# EAGLE design stm32-stamp64 (EAGLE 5.11)

## Sheet 1 of 2
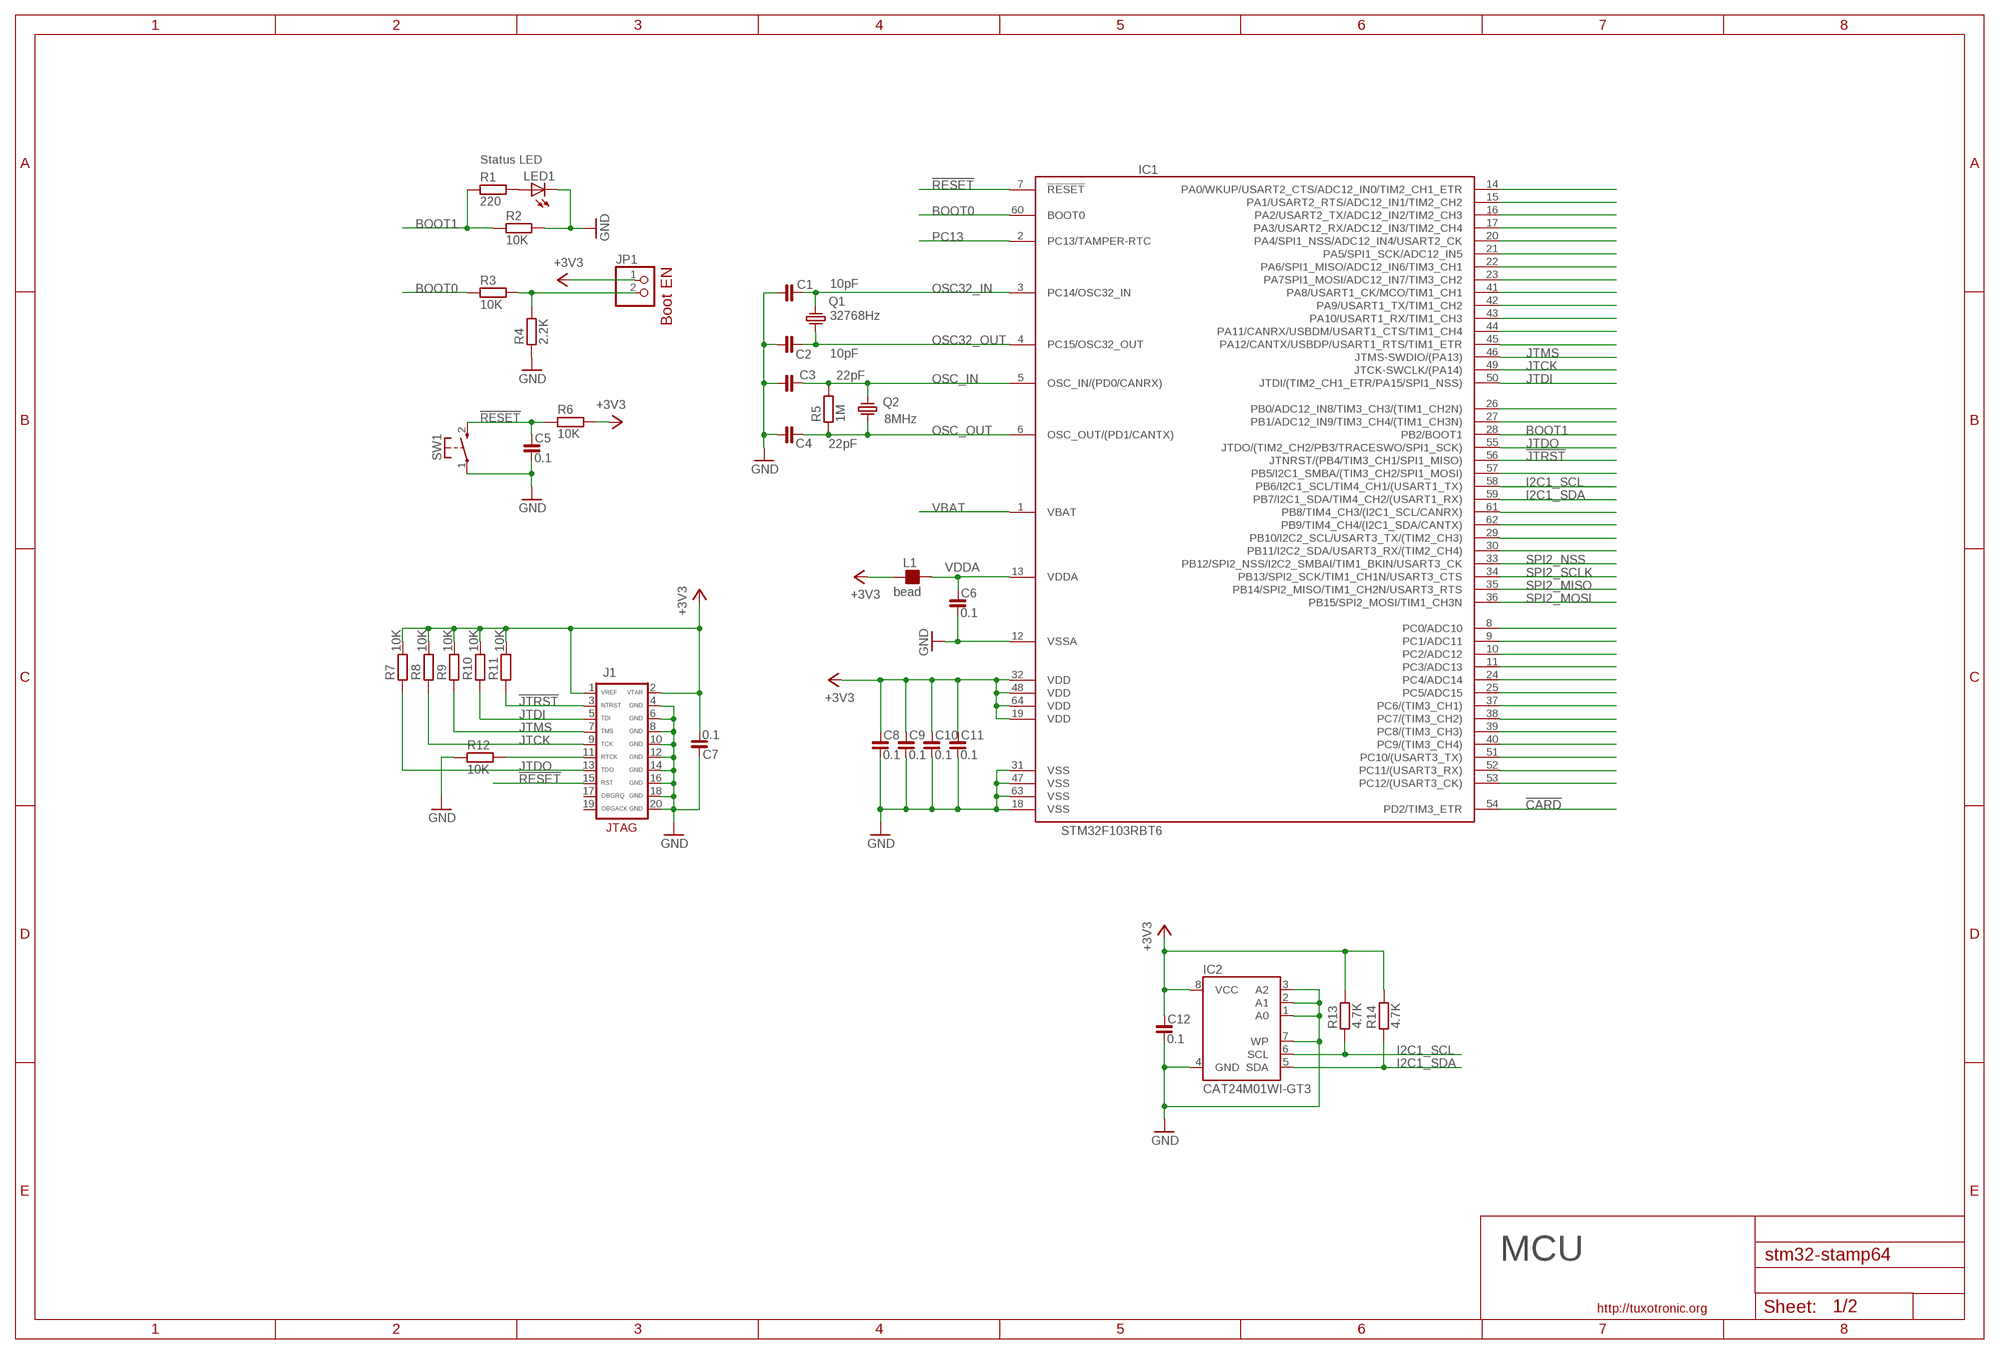
[diagram p0: schematic, sheet 1]

### Parts
C1  10pF  C_0603  [C0603]
C2  10pF  C_0603  [C0603]
C3  22pF  C_0603  [C0603]
C4  22pF  C_0603  [C0603]
C5  0.1  C_0603  [C0603]
C6  0.1  C_0603  [C0603]
C7  0.1  C_0603  [C0603]
C8  0.1  C_0603  [C0603]
C9  0.1  C_0603  [C0603]
C10  0.1  C_0603  [C0603]
C11  0.1  C_0603  [C0603]
C12  0.1  C_0603  [C0603]
IC1  STM32F103RBT6  STM32F103R  [TQFP64]
IC2  CAT24M01WI-GT3  AT24C256S  [SO08]
J1  JTAG-ARM-HDR2MM  [2X10M]
JP1  PINHD-1X2_2.00  [1X02M]
L1  bead  FB_0603  [L0603]
LED1  LEDCHIP-LED0805  [CHIP-LED0805]
Q1  32768Hz  CRYSTAL-TC26H  [TC26H]
Q2  8MHz  CRYSTAL-HC49S  [HC49/S]
R1  220  R_0603  [R0603]
R2  10K  R_0603  [R0603]
R3  10K  R_0603  [R0603]
R4  2.2K  R_0603  [R0603]
R5  1M  R_0603  [R0603]
R6  10K  R_0603  [R0603]
R7  10K  R_0603  [R0603]
R8  10K  R_0603  [R0603]
R9  10K  R_0603  [R0603]
R10  10K  R_0603  [R0603]
R11  10K  R_0603  [R0603]
R12  10K  R_0603  [R0603]
R13  4.7K  R_0603  [R0603]
R14  4.7K  R_0603  [R0603]
SW1  KSS-2EG4430  [KSS-2EG4430]

### Nets
!CARD: IC1.54(PD2/TIM3_ETR) ; also sheet 2
!JTRST: IC1.56(JTNRST/(PB4/TIM3_CH1/SPI1_MISO)) J1.3(NTRST) R11.1
!RESET: C5.1 IC1.7(!RESET) J1.15(RST) R6.1 SW1.2(S)
+3V3: C7.2 C8.1 C9.1 C10.1 C11.1 C12.1 IC1.19(VDD) IC1.32(VDD) IC1.48(VDD) IC1.64(VDD) IC2.8(VCC) J1.1(VREF) J1.2(VTAR) JP1.1 L1.1 R6.2 R7.2 R8.2 R9.2 R10.2 R11.2 R13.2 R14.2 ; also sheet 2
BOOT0: IC1.60(BOOT0) R3.1
BOOT1: IC1.28(PB2/BOOT1) R1.1 R2.1
GND: C1.2 C2.2 C3.2 C4.2 C5.2 C6.2 C7.1 C8.2 C9.2 C10.2 C11.2 C12.2 IC1.12(VSSA) IC1.18(VSS) IC1.31(VSS) IC1.47(VSS) IC1.63(VSS) IC2.1(A0) IC2.2(A1) IC2.3(A2) IC2.4(GND) IC2.7(WP) J1.4(GND) J1.6(GND) J1.8(GND) J1.10(GND) J1.12(GND) J1.14(GND) J1.16(GND) J1.18(GND) J1.20(GND) LED1.C R2.2 R4.1 R12.1 SW1.1(P) ; also sheet 2
I2C1_SCL: IC1.58(PB6/I2C1_SCL/TIM4_CH1/(USART1_TX)) IC2.6(SCL) R13.1
I2C1_SDA: IC1.59(PB7/I2C1_SDA/TIM4_CH2/(USART1_RX)) IC2.5(SDA) R14.1
JTCK: IC1.49(JTCK-SWCLK/(PA14)) J1.9(TCK) R8.1
JTDI: IC1.50(JTDI/(TIM2_CH1_ETR/PA15/SPI1_NSS)) J1.5(TDI) R10.1
JTDO: IC1.55(JTDO/(TIM2_CH2/PB3/TRACESWO/SPI1_SCK)) J1.13(TDO) R7.1
JTMS: IC1.46(JTMS-SWDIO/(PA13)) J1.7(TMS) R9.1
N$3: JP1.2 R3.2 R4.2
N$6: J1.11(RTCK) R12.2
N$11: IC1.14(PA0/WKUP/USART2_CTS/ADC12_IN0/TIM2_CH1_ETR)
N$12: IC1.15(PA1/USART2_RTS/ADC12_IN1/TIM2_CH2)
N$13: IC1.16(PA2/USART2_TX/ADC12_IN2/TIM2_CH3)
N$14: IC1.17(PA3/USART2_RX/ADC12_IN3/TIM2_CH4)
N$15: IC1.20(PA4/SPI1_NSS/ADC12_IN4/USART2_CK)
N$16: IC1.21(PA5/SPI1_SCK/ADC12_IN5)
N$17: IC1.22(PA6/SPI1_MISO/ADC12_IN6/TIM3_CH1)
N$18: IC1.23(PA7SPI1_MOSI/ADC12_IN7/TIM3_CH2)
N$19: IC1.41(PA8/USART1_CK/MCO/TIM1_CH1)
N$20: IC1.42(PA9/USART1_TX/TIM1_CH2)
N$21: IC1.43(PA10/USART1_RX/TIM1_CH3)
N$22: IC1.44(PA11/CANRX/USBDM/USART1_CTS/TIM1_CH4)
N$23: IC1.45(PA12/CANTX/USBDP/USART1_RTS/TIM1_ETR)
N$24: IC1.26(PB0/ADC12_IN8/TIM3_CH3/(TIM1_CH2N))
N$25: IC1.27(PB1/ADC12_IN9/TIM3_CH4/(TIM1_CH3N))
N$26: IC1.57(PB5/I2C1_SMBA/(TIM3_CH2/SPI1_MOSI))
N$27: IC1.61(PB8/TIM4_CH3/(I2C1_SCL/CANRX))
N$28: IC1.62(PB9/TIM4_CH4/(I2C1_SDA/CANTX))
N$29: IC1.29(PB10/I2C2_SCL/USART3_TX/(TIM2_CH3))
N$30: LED1.A R1.2
N$31: IC1.30(PB11/I2C2_SDA/USART3_RX/(TIM2_CH4))
N$33: IC1.53(PC12/(USART3_CK))
N$34: IC1.52(PC11/(USART3_RX))
N$35: IC1.51(PC10/(USART3_TX))
N$36: IC1.40(PC9/(TIM3_CH4))
N$37: IC1.39(PC8/(TIM3_CH3))
N$38: IC1.38(PC7/(TIM3_CH2))
N$39: IC1.37(PC6/(TIM3_CH1))
N$40: IC1.25(PC5/ADC15)
N$41: IC1.24(PC4/ADC14)
N$42: IC1.11(PC3/ADC13)
N$43: IC1.10(PC2/ADC12)
N$44: IC1.9(PC1/ADC11)
N$45: IC1.8(PC0/ADC10)
OSC32_IN: C1.1 IC1.3(PC14/OSC32_IN) Q1.2
OSC32_OUT: C2.1 IC1.4(PC15/OSC32_OUT) Q1.1
OSC_IN: C3.1 IC1.5(OSC_IN/(PD0/CANRX)) Q2.1 R5.2
OSC_OUT: C4.1 IC1.6(OSC_OUT/(PD1/CANTX)) Q2.2 R5.1
PC13: IC1.2(PC13/TAMPER-RTC)
SPI2_MISO: IC1.35(PB14/SPI2_MISO/TIM1_CH2N/USART3_RTS) ; also sheet 2
SPI2_MOSI: IC1.36(PB15/SPI2_MOSI/TIM1_CH3N) ; also sheet 2
SPI2_NSS: IC1.33(PB12/SPI2_NSS/I2C2_SMBAI/TIM1_BKIN/USART3_CK) ; also sheet 2
SPI2_SCLK: IC1.34(PB13/SPI2_SCK/TIM1_CH1N/USART3_CTS) ; also sheet 2
VBAT: IC1.1(VBAT)
VDDA: C6.1 IC1.13(VDDA) L1.2
Unconnected: J1.17(OBGRQ) J1.19(OBGACK)

### Notes on the sheet
- Status LED
- Boot EN
- MCU

## Sheet 2 of 2
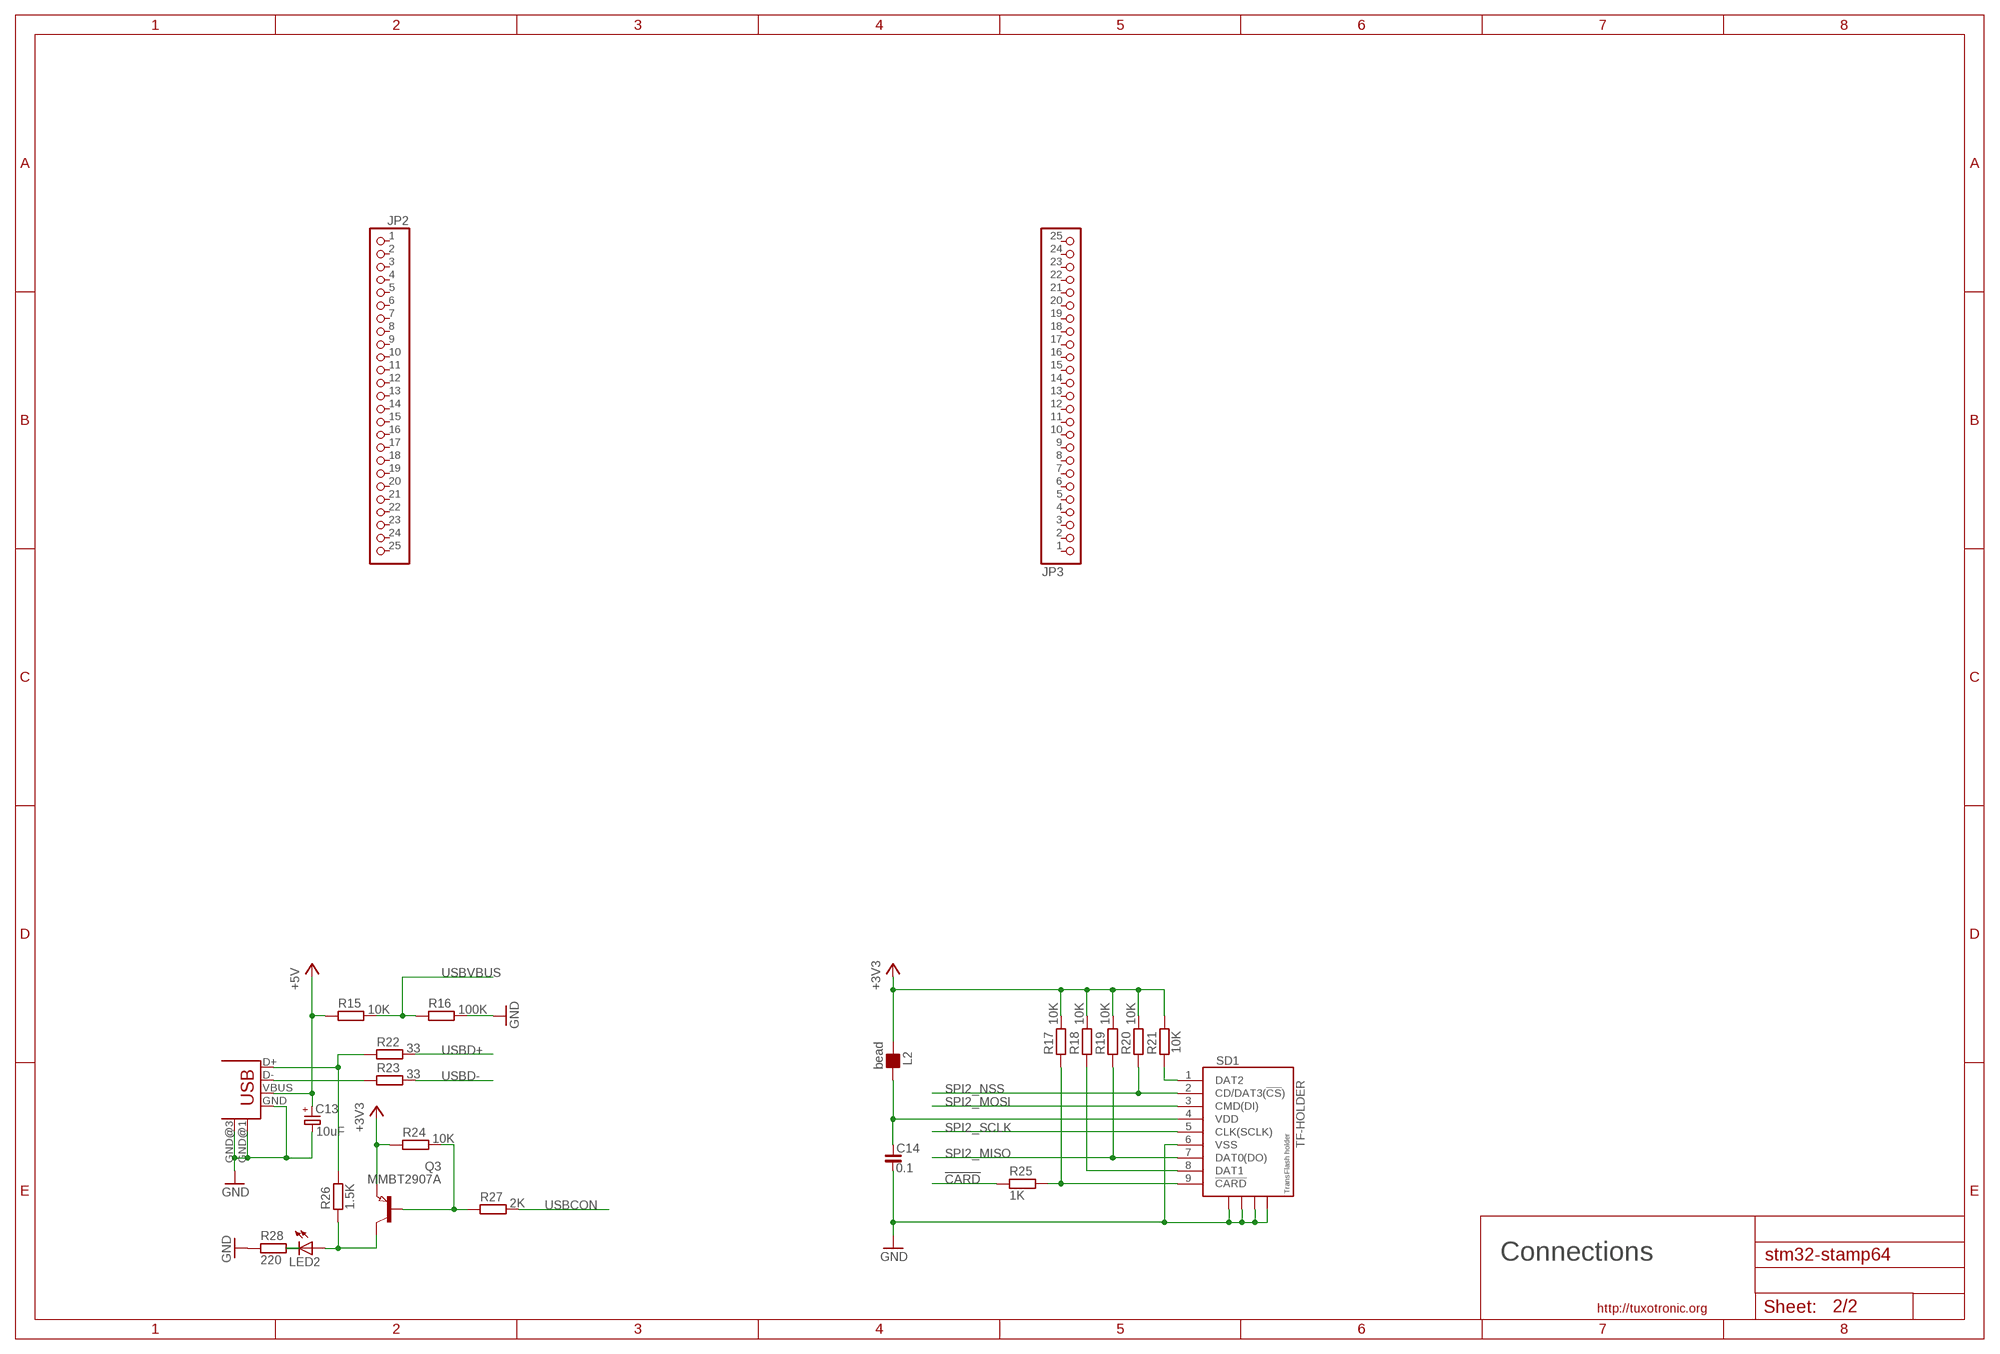
[diagram p1: schematic, sheet 2]

### Parts
C13  10uF  CP_SMCA  [SMC_A]
C14  0.1  C_0603  [C0603]
JP2  PINHD-1X25_2.00  [1X25M]
JP3  PINHD-1X25_2.00  [1X25M]
L2  bead  FB_0603  [L0603]
LED2  LEDCHIP-LED0603  [CHIP-LED0603]
Q3  MMBT2907A  PNP-TRANSISTOR_SOT23  [SOT23]
R15  10K  R_0603  [R0603]
R16  100K  R_0603  [R0603]
R17  10K  R_0603  [R0603]
R18  10K  R_0603  [R0603]
R19  10K  R_0603  [R0603]
R20  10K  R_0603  [R0603]
R21  10K  R_0603  [R0603]
R22  33  R_0603  [R0603]
R23  33  R_0603  [R0603]
R24  10K  R_0603  [R0603]
R25  1K  R_0603  [R0603]
R26  1.5K  R_0603  [R0603]
R27  2K  R_0603  [R0603]
R28  220  R_0603  [R0603]
SD1  TF-HOLDER  [TF-PULL]
USB1  USB-MB-S  [USB-MB-S]

### Nets
!CARD: R25.1 ; also sheet 1
!CD: R17.1 R25.2 SD1.9(!CARD)
+3V3: L2.1 Q3.2(E) R17.2 R18.2 R19.2 R20.2 R21.2 R24.1 ; also sheet 1
+5V: C13.+ R15.1 USB1.VBUS
GND: C13.- C14.2 R16.2 R28.1 SD1.6(VSS) SD1.S1 SD1.S2 SD1.S3 SD1.S4 USB1.GND USB1.GND@1(GND) USB1.GND@3(GND) ; also sheet 1
N$1: C14.1 L2.2 SD1.4(VDD)
N$2: R21.1 SD1.1(DAT2)
N$4: R18.1 SD1.8(DAT1)
N$5: R23.1 USB1.D-
N$7: Q3.1(B) R24.2 R27.1
N$8: R22.1 R26.2 USB1.D+
N$9: LED2.C R28.2
N$10: LED2.A Q3.3(C) R26.1
SPI2_MISO: R19.1 SD1.7(DAT0(DO)) ; also sheet 1
SPI2_MOSI: SD1.3(CMD(DI)) ; also sheet 1
SPI2_NSS: R20.1 SD1.2(CD/DAT3(!CS!)) ; also sheet 1
SPI2_SCLK: SD1.5(CLK(SCLK)) ; also sheet 1
USBCON: R27.2
USBD+: R22.2
USBD-: R23.2
USBVBUS: R15.2 R16.1
Unconnected: JP2.1 JP2.2 JP2.3 JP2.4 JP2.5 JP2.6 JP2.7 JP2.8 JP2.9 JP2.10 JP2.11 JP2.12 JP2.13 JP2.14 JP2.15 JP2.16 JP2.17 JP2.18 JP2.19 JP2.20 JP2.21 JP2.22 JP2.23 JP2.24 JP2.25 JP3.1 JP3.2 JP3.3 JP3.4 JP3.5 JP3.6 JP3.7 JP3.8 JP3.9 JP3.10 JP3.11 JP3.12 JP3.13 JP3.14 JP3.15 JP3.16 JP3.17 JP3.18 JP3.19 JP3.20 JP3.21 JP3.22 JP3.23 JP3.24 JP3.25

### Notes on the sheet
- Connections

## Library data of the parts
C1-C12 C14 = rc-master-smd:C_: NON-POLARIZED CAP
C13 = rc-master-smd:CP_: POLARIZED CAP
IC1 = stm32:STM32F103R: Medium-density performance line ARM-based 32-bit MCU with 64 or 128 KB Flash, USB, CAN, 7 timers, 2 ADCs, 9 communication interfaces
IC2 = stm32-by-pb:AT24C*: 2-wire serial EEPROM
J1 = atmel-arm:JTAG-ARM-: JTAG Programming/Debug Connector
JP1 = pinhead-fixdrills:PINHD-1X2: PIN HEADER
JP2 JP3 = pinhead-fixdrills:PINHD-1X25: PIN HEADER
L1 L2 = rc-master-smd:FB_: FERRITE BEAD
LED1 LED2 = led:LED: LED OSRAM: - CHIPLED LG R971, LG N971, LY N971, LG Q971, LY Q971, LO R971, LY R971 LH N974, LH R974 LS Q976, LO Q976, LY Q976 LO Q996 - Hyper CHIPLED LW Q18S LB Q993, LB Q99A, LB R99A - SideLED LS A670, LO A670, LY A670, LG A670, LP A670 LB A673, LV A673, LT A673, LW A673 LH A674 LY A675 LS A676, LA A676, LO A676, LY A676, LW A676 LS A679, LY A679, LG A679 - Hyper Micro SIDELED® LS Y876, LA Y876, LO Y876, LY Y876 LT Y87S - SmartLED LW L88C, LW L88S LB L89C, LB L89S, LG L890 LS L89K, LO L89K, LY L89K LS L896, LA L896, LO L896, LY L896 - TOPLED LS T670, LO T670, LY T670, LG T670, LP T670 LSG T670, LSP T670, LSY T670, LOP T670, LYG T670 LG T671, LOG T671, LSG T671 LB T673, LV T673, LT T673, LW T673 LH T674 LS T676, LA T676, LO T676, LY T676, LB T676, LH T676, LSB T676, LW T676 LB T67C, LV T67C, LT T67C, LS T67K, LO T67K, LY T67K, LW E67C LS E67B, LA E67B, LO E67B, LY E67B, LB E67C, LV E67C, LT E67C LW T67C LS T679, LY T679, LG T679 LS T770, LO T770, LY T770, LG T770, LP T770 LB T773, LV T773, LT T773, LW T773 LH T774 LS E675, LA E675, LY E675, LS T675 LS T776, LA T776, LO T776, LY T776, LB T776 LHGB T686 LT T68C, LB T68C - Hyper Mini TOPLED® LB M676 - Mini TOPLED Santana® LG M470 LS M47K, LO M47K, LY M47K Source: http://www.osram.convergy.de - LUMILED® LXK2-PW12-R00, LXK2-PW12-S00, LXK2-PW14-U00, LXK2-PW14-V00 LXK2-PM12-R00, LXK2-PM12-S00, LXK2-PM14-U00 LXK2-PE12-Q00, LXK2-PE12-R00, LXK2-PE12-S00, LXK2-PE14-T00, LXK2-PE14-U00 LXK2-PB12-K00, LXK2-PB12-L00, LXK2-PB12-M00, LXK2-PB14-N00, LXK2-PB14-P00, LXK2-PB14-Q00 LXK2-PR12-L00, LXK2-PR12-M00, LXK2-PR14-Q00, LXK2-PR14-R00 LXK2-PD12-Q00, LXK2-PD12-R00, LXK2-PD12-S00 LXK2-PH12-R00, LXK2-PH12-S00 LXK2-PL12-P00, LXK2-PL12-Q00, LXK2-PL12-R00 Source: www.luxeon.com
Q1 Q2 = discrete:CRYSTAL-: CRYSTAL
Q3 = semicon-smd-ipc:PNP-TRANSISTOR_: PNP TRANSISTOR
R1-R28 = rc-master-smd:R_: RESISTOR
SD1 = sd-mmc:TF-HOLDER: TF / Micro SD socket is PUSH-PUSH type, the card can be pushed into and auto locked and pushed out by simply press the card. Surface Mounting type.
SW1 = buttons:KSS-2EG4430: Size: 3x6mm Height: 5mm from PCB Rating: DC12v 50mA Travel: 0.25±0.10mm Operating Force: 180±50gf Return Force: 60gf min Contact resistance: 100m? max Insulation resistance: 100M? min Operating life?50,000 cycles
USB1 = usb:USB: USB Connectors

## Board
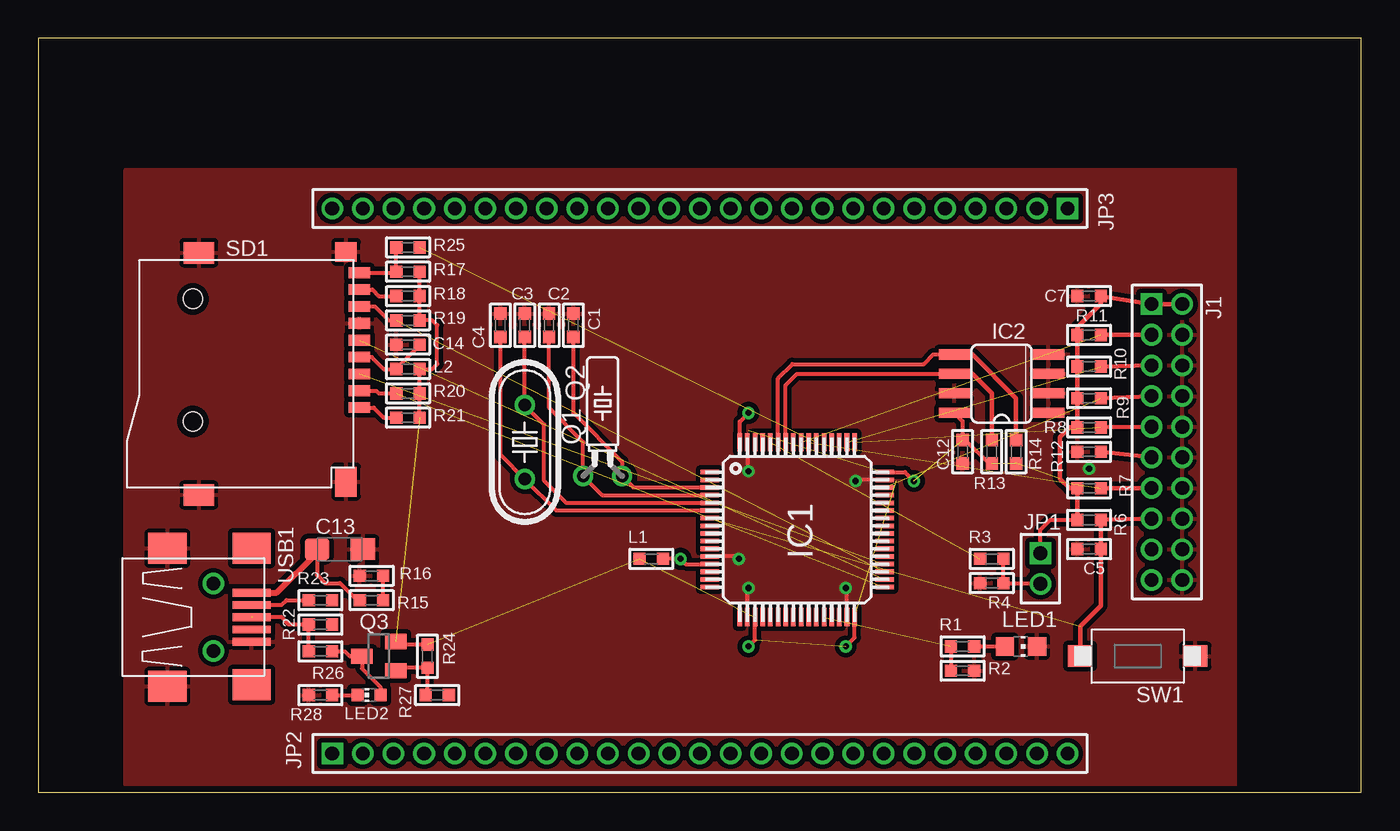
[diagram p2: board, top side]
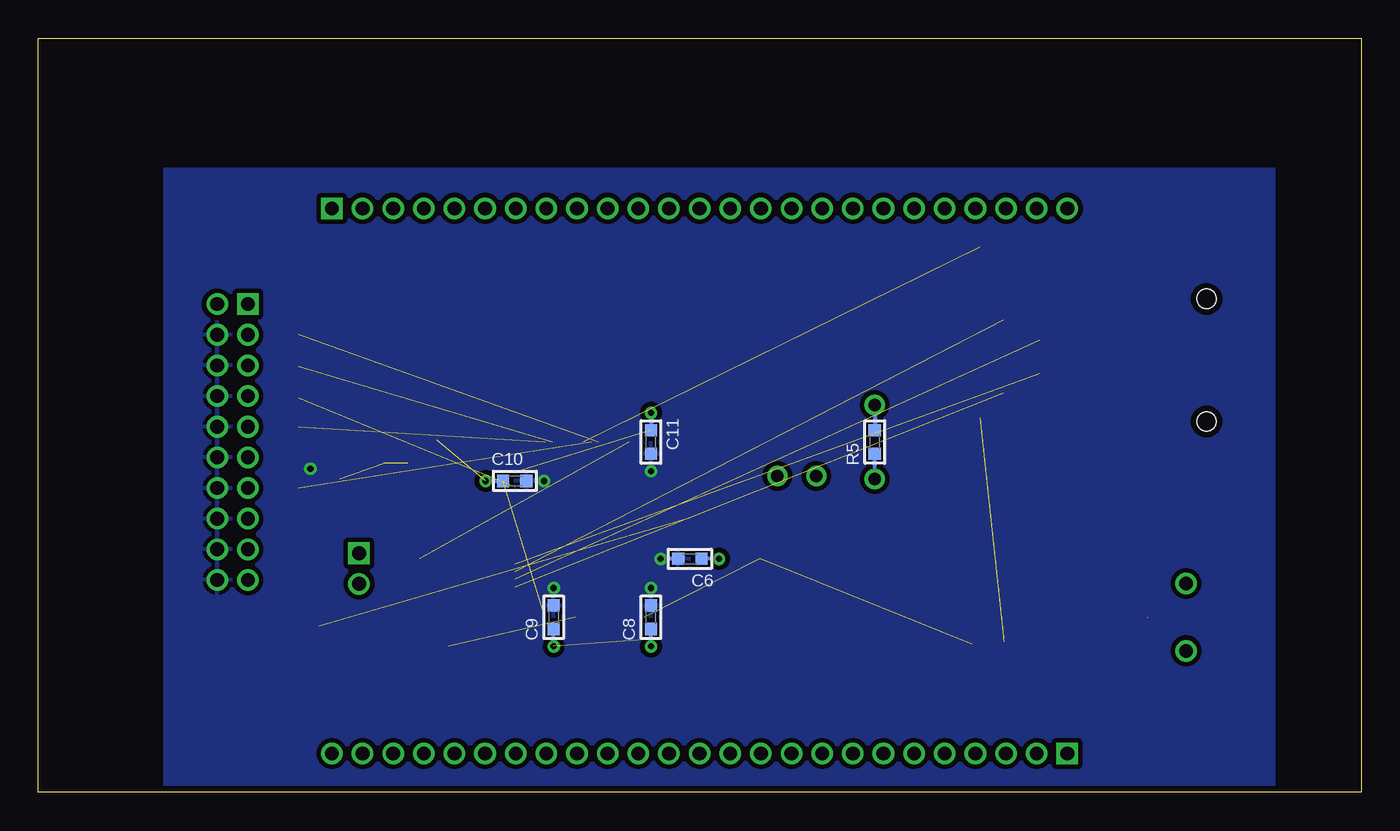
[diagram p3: board, bottom side, seen from below]

Size 86.34 x 49.2 mm. Coordinates in mm from the lower left corner, seen from the top.
Outline: 0,0 86.34,0 86.34,49.2 0,49.2 0,0
Copper layers (1*16): Top 0.035mm / dielectric 1.5mm / Bottom 0.035mm
Design rules "default *": minimum track width 0.16mm, minimum drill 0.4mm, track to track 0.16mm, track to pad 0.16mm, pad to pad 0.16mm, via to via 0.16mm, smd to smd 0.16mm, copper to edge 0.4mm, drill to drill 8mil, minimum pad ring 10mil, minimum via ring 8mil, stop-mask expansion 4mil, vias tented up to drill 0.6mm, thermal gap 10mil

### Footprints (pad centres in the part's own frame; a part is rotated, then mirrored left to right if it is on the bottom)
C0603 = smd 0.8 x 0.8: 1 -0.762,0; 2 0.762,0
SMC_A = smd 1.6 x 1.4: + -1.5,0; - 1.5,0
TQFP64 = smd 1.2 x 0.3: 1 -5.7,3.75; 2 -5.7,3.25; 3 -5.7,2.75; 4 -5.7,2.25; 5 -5.7,1.75; 6 -5.7,1.25; 7 -5.7,0.75; 8 -5.7,0.25; 9 -5.7,-0.25; 10 -5.7,-0.75; 11 -5.7,-1.25; 12 -5.7,-1.75; 13 -5.7,-2.25; 14 -5.7,-2.75; 15 -5.7,-3.25; 16 -5.7,-3.75; 33 5.7,-3.75; 34 5.7,-3.25; 35 5.7,-2.75; 36 5.7,-2.25; 37 5.7,-1.75; 38 5.7,-1.25; 39 5.7,-0.75; 40 5.7,-0.25; 41 5.7,0.25; 42 5.7,0.75; 43 5.7,1.25; 44 5.7,1.75; 45 5.7,2.25; 46 5.7,2.75; 47 5.7,3.25; 48 5.7,3.75 | smd 0.3 x 1.2: 17 -3.75,-5.7; 18 -3.25,-5.7; 19 -2.75,-5.7; 20 -2.25,-5.7; 21 -1.75,-5.7; 22 -1.25,-5.7; 23 -0.75,-5.7; 24 -0.25,-5.7; 25 0.25,-5.7; 26 0.75,-5.7; 27 1.25,-5.7; 28 1.75,-5.7; 29 2.25,-5.7; 30 2.75,-5.7; 31 3.25,-5.7; 32 3.75,-5.7; 49 3.75,5.7; 50 3.25,5.7; 51 2.75,5.7; 52 2.25,5.7; 53 1.75,5.7; 54 1.25,5.7; 55 0.75,5.7; 56 0.25,5.7; 57 -0.25,5.7; 58 -0.75,5.7; 59 -1.25,5.7; 60 -1.75,5.7; 61 -2.25,5.7; 62 -2.75,5.7; 63 -3.25,5.7; 64 -3.75,5.7
SO08 = smd 0.66 x 2.032: 1 -1.905,-3.073; 2 -0.635,-3.073; 3 0.635,-3.073; 4 1.905,-3.073; 5 1.905,3.073; 6 0.635,3.073; 7 -0.635,3.073; 8 -1.905,3.073
2X10M = drill 0.9 square: 1 -9,-1 | drill 0.9 round: 2 -9,1; 3 -7,-1; 4 -7,1; 5 -5,-1; 6 -5,1; 7 -3,-1; 8 -3,1; 9 -1,-1; 10 -1,1; 11 1,-1; 12 1,1; 13 3,-1; 14 3,1; 15 5,-1; 16 5,1; 17 7,-1; 18 7,1; 19 9,-1; 20 9,1
1X02M = drill 0.9 square: 1 -1,0 | drill 0.9 round: 2 1,0
1X25M = drill 0.9 square: 1 -24,0 | drill 0.9 round: 2 -22,0; 3 -20,0; 4 -18,0; 5 -16,0; 6 -14,0; 7 -12,0; 8 -10,0; 9 -8,0; 10 -6,0; 11 -4,0; 12 -2,0; 13 0,0; 14 2,0; 15 4,0; 16 6,0; 17 8,0; 18 10,0; 19 12,0; 20 14,0; 21 16,0; 22 18,0; 23 20,0; 24 22,0; 25 24,0
L0603 = smd 0.8 x 0.8: 1 -0.762,0; 2 0.762,0
CHIP-LED0805 = smd 1.2 x 1.2: A 0,-1.05; C 0,1.05
CHIP-LED0603 = smd 0.8 x 0.8: A 0,-0.75; C 0,0.75
TC26H = drill 0.813 round: 1 -1.27,0; 2 1.27,0
HC49/S = drill 0.813 round: 1 -2.413,0; 2 2.413,0
SOT23 = smd 1 x 1.4: 1 -0.95,-1.1; 2 0.95,-1.1; 3 0,1.1
R0603 = smd 0.8 x 0.8: 1 -0.762,0; 2 0.762,0
TF-PULL = smd 0.7 x 1.4: 1 -2.2,-7.62; 2 -1.1,-7.62; 3 0,-7.62; 4 1.1,-7.62; 5 2.2,-7.62; 6 3.3,-7.62; 7 4.4,-7.62; 8 5.5,-7.62; 9 6.6,-7.62 | smd 1.4 x 2: S1 -7.9,2.85; S2 7.9,2.85 | smd 1.28 x 1.4: S3 7.96,-6.75 | smd 1.95 x 1.4: S4 -7.025,-6.75 | hole 1.25: -3.1,3.25; 4.9,3.25
KSS-2EG4430 = smd 1.6 x 1.4: 1 -3.75,0; 2 3.75,0
USB-MB-S = smd 2.5 x 0.5: D+ 2.5,0; D- 2.5,0.8; GND 2.5,-1.6; ID 2.5,-0.8; VBUS 2.5,1.6 | smd 2.5 x 2: GND@1 -3,4.5; GND@2 2.5,4.5; GND@3 -3,-4.5; GND@4 2.5,-4.4 | drill 0.9 round: P$5 0,2.2; P$6 0,-2.2

### Placement (x,y rotation side)
C1  34.92,30.48 90 top
C2  33.34,30.48 90 top
C3  31.75,30.48 90 top
C4  30.16,30.48 90 top
C5  68.58,15.88 180 top
C6  43.81,15.24 180 bottom
C7  68.58,32.38 0 top
C8  46.35,11.43 90 bottom
C9  52.7,11.43 90 bottom
C10  55.24,20.32 0 bottom
C11  46.35,22.86 270 bottom
C12  60.33,22.23 270 top
C13  19.68,15.88 0 top
C14  24.13,29.21 180 top
IC1  49.53,17.14 0 top
IC2  62.87,26.67 90 top
J1  73.66,22.86 270 top
JP1  65.41,14.61 270 top
JP2  43.18,2.54 0 top
JP3  43.18,38.1 180 top
L1  40.01,15.24 0 top
L2  24.13,27.62 180 top
LED1  64.14,9.53 270 top
LED2  21.59,6.35 90 top
Q1  36.83,20.64 0 top
Q2  31.75,22.86 270 top
Q3  22.23,8.89 90 top
R1  60.33,9.53 0 top
R2  60.33,7.94 0 top
R3  62.23,15.24 0 top
R4  62.23,13.65 0 top
R5  31.75,22.86 90 bottom
R6  68.58,17.78 180 top
R7  68.58,19.84 180 top
R8  68.58,23.81 180 top
R9  68.58,25.72 180 top
R10  68.58,27.78 180 top
R11  68.58,29.84 180 top
R12  68.58,22.23 0 top
R13  62.23,22.23 270 top
R14  63.82,22.23 270 top
R15  21.75,12.54 0 top
R16  21.75,14.13 180 top
R17  24.13,33.97 0 top
R18  24.13,32.38 0 top
R19  24.13,30.8 0 top
R20  24.13,26.04 0 top
R21  24.13,24.45 0 top
R22  18.41,10.95 0 top
R23  18.41,12.54 0 top
R24  25.4,8.89 270 top
R25  24.13,35.56 180 top
R26  18.41,9.21 180 top
R27  26.04,6.35 0 top
R28  18.41,6.35 0 top
SD1  13.34,27.3 90 top
SW1  71.75,8.89 180 top
USB1  11.43,11.43 0 top

### Tracks (layer width: path | path; a pad name or v marks a point on that pad's centre or on a via)
!CARD  (1 unrouted)
!CD
  Top 0.254: R25.2 R17.1 23.3,33.91 SD1.9
!JTRST  (1 unrouted)
  Top 0.305: R11.1 J1.3
!RESET  (1 unrouted)
  Top 0.305: J1.15 R6.1 C5.1 69.34,12.19 68,10.86 SW1.2
+3V3  (via drill 0.4)  (9 unrouted)
  Top 0.254: IC1.64 45.78,24.19 v46.35,24.77 | IC1.19 46.78,9.95 v46.35,9.53 | IC1.32 53.28,10.1 v52.7,9.53 | IC1.48 56.58,20.89 v57.15,20.32 | R13.2 62.04,21.46 60.52,22.99 C12.1 60.33,24.23 IC2.8 | R24.1 23.51,9.65 Q3.2 | R17.2 R18.2 R19.2 25.72,30.8 26.04,30.48 26.04,27.94 25.72,27.62 L2.1 R20.2 R21.2 | JP1.1 65.41,17.14 66.04,17.78 R6.2
  Top 0.305: J1.2 J1.1 C7.2 69.34,31.88 67.82,30.35 R11.2 R10.2 R9.2 R8.2 67.31,23.81 66.67,23.18 66.67,20.48 67.31,19.84 R7.2 R6.2
  Bottom 0.254: v46.35,24.77 C11.1 | v46.35,9.53 C8.1 | v52.7,9.53 C9.1 | v57.15,20.32 C10.1
+5V
  Top 0.254: R15.1 20.8,12.54 19.68,13.65 18.73,13.65 18.18,14.2 18.18,15.64
  Top 0.406: USB1.VBUS 15.57,13.03 18.18,15.64 C13.+
BOOT0  (1 unrouted)
BOOT1  (1 unrouted)
  Top 0.254: R1.1 R2.1
GND  (via drill 0.4)
  Top 0.254: IC1.31 52.78,13.26 v52.7,13.34 | IC1.47 53.41,20.39 v53.34,20.32 | IC1.63 46.28,21.03 v46.35,20.95 | IC1.18 46.28,13.26 v46.35,13.34 | IC1.12 45.56,15.39 v45.72,15.24
  Bottom 0.254: C6.2 v45.72,15.24
  other vias: 68.58,21.11
  pour Top (isolate 0.305): 78.11,0 5.71,0 5.71,40.64 78.11,40.64
  pour Bottom (isolate 0.305): 78.11,0 5.71,0 5.71,40.64 78.11,40.64
I2C1_SCL
  Top 0.254: IC2.6 49.53,27.3 48.78,26.55 IC1.58
  Top 0.305: R13.1 62.23,26.04 60.96,27.3 IC2.6
I2C1_SDA
  Top 0.254: IC1.59 48.28,27.01 49.21,27.94 57.78,27.94 58.42,28.57 IC2.5
  Top 0.305: R14.1 63.82,25.72 60.96,28.57 IC2.5
JTCK  (1 unrouted)
  Top 0.305: R8.1 J1.9
JTDI  (1 unrouted)
  Top 0.305: R10.1 J1.5
JTDO  (1 unrouted)
  Top 0.305: R7.1 J1.13
JTMS  (1 unrouted)
  Top 0.305: R9.1 J1.7
N$1
  Top 0.254: SD1.4 21.76,28.41 22.54,27.62 L2.2 23.37,27.65 24.89,29.18 C14.1
N$2
  Top 0.254: R21.1 22.54,24.45 21.89,25.11 SD1.1
N$3
  Top 0.254: JP1.2 65.36,13.65 R4.2 R3.2
N$4
  Top 0.254: SD1.8 21.8,32.8 22.23,32.38 R18.1
N$5
  Top 0.254: R23.1 16.19,12.54 15.88,12.23 USB1.D-
N$6
  Top 0.305: R12.2 J1.11
N$7
  Top 0.254: Q3.1 23.51,8.13 R24.2 25.4,6.48 R27.1
N$8  (1 unrouted)
  Top 0.254: R26.2 R22.1 16.35,10.95 15.88,11.43 13.97,11.43
N$9
  Top 0.254: R28.2 LED2.C
N$10
  Top 0.254: LED2.A 22.34,6.87 21.12,8.09 Q3.3 20.32,8.89 20,9.21 R26.1
N$30
  Top 0.254: R1.2 LED1.A
OSC32_IN
  Top 0.254: IC1.3 38.84,19.89 Q1.2 38.1,21.59 34.92,24.77 C1.1
OSC32_OUT
  Top 0.254: IC1.4 36.8,19.39 Q1.1 35.56,22.86 33.34,25.08 C2.1
OSC_IN
  Top 0.254: IC1.5 34.45,18.89 33.02,20.32 33.02,24 Q2.1 C3.1
  Bottom 0.254: Q2.1 R5.2
OSC_OUT
  Top 0.254: IC1.6 33.8,18.39 Q2.2 30.16,22.04 C4.1
  Bottom 0.254: Q2.2 R5.1
SPI2_MISO  (1 unrouted)
  Top 0.254: SD1.7 21.95,31.7 22.86,30.8 R19.1
SPI2_MOSI  (1 unrouted)
SPI2_NSS  (1 unrouted)
  Top 0.254: SD1.2 22.05,26.2 22.23,26.04 R20.1
SPI2_SCLK  (1 unrouted)
USBVBUS
  Top 0.254: R15.2 R16.1 | R16.1
VDDA  (via drill 0.4)
  Top 0.254: IC1.13 42.26,14.89 v41.91,15.24 L1.2
  Bottom 0.254: v41.91,15.24 C6.1